# Altium schematic sheet H_Connecties.SchDoc
size A4; SheetNumber: 2; SheetTotal: 5
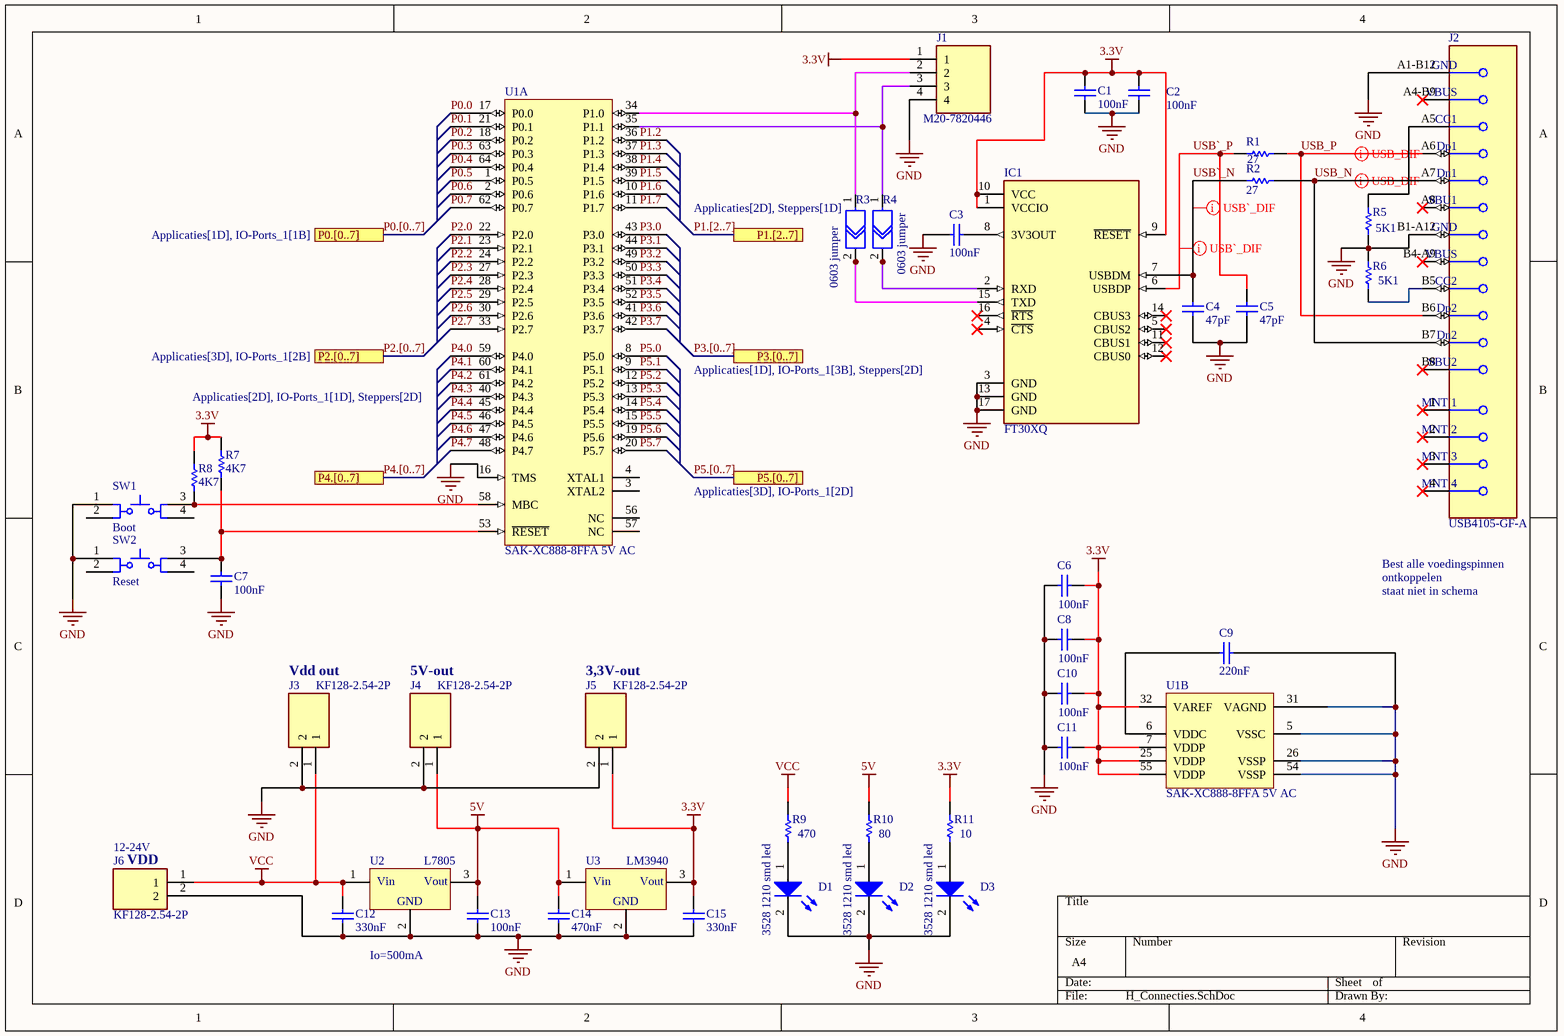
[diagram p0: H_Connecties.SchDoc]

## Parts
C1  100nF  [CAPC1608X90X35LL15T15]
C2  100nF  [CAPC1608X90X35LL15T15]
C3  100nF  [CAPC1608X90X35LL15T15]
C4  47pF  [CAPC1608X90X35LL15T15]
C5  47pF  [CAPC1608X90X35LL15T15]
C6  100nF  [CAPC1608X92X38NL15T08]
C7  100nF  [CAPC1608X90X35LL15T15]
C8  100nF  [CAPC1608X92X38NL15T08]
C9  220nF  [CAPC1608X95X40LL15T15]
C10  100nF  [CAPC1608X92X38NL15T08]
C11  100nF  [CAPC1608X92X38NL15T08]
C12  330nF  [CAPC1608X90X35LL15T15]
C13  100nF  [CAPC1608X90X35LL15T15]
C14  470nF  [CAPC1608X90X35LL15T15]
C15  330nF  [CAPC1608X90X35LL15T15]
D1  3528 1210 smd led  [WL-SITW_3528_L3.5W2.8H1.9]
D2  3528 1210 smd led  [WL-SITW_3528_L3.5W2.8H1.9]
D3  3528 1210 smd led  [WL-SITW_3528_L3.5W2.8H1.9]
IC1  FT30XQ  [FT30XQ]
J1  M20-7820446  [M20-4pin]
J2  USB4105-GF-A  [FP-USB4105-GF-A-MFG]
J3  KF128-2.54-2P  [KF128-2.54-2P]
J4  KF128-2.54-2P  [KF128-2.54-2P]
J5  KF128-2.54-2P  [KF128-2.54-2P]
J6  KF128-2.54-2P  [KF128-2.54-2P]
R1  27  [RESC1608X55X25LL10T15]
R2  27  [RESC1608X55X25LL10T15]
R3  0603 jumper  [0603 jumper]
R4  0603 jumper  [0603 jumper]
R5  5K1  [RESC1608X55X25LL10T15]
R6  5K1  [RESC1608X55X25LL10T15]
R7  4K7  [RESC1608X55X25LL10T15]
R8  4K7  [RESC1608X55X25LL10T15]
R9  470  [RESC1608X55X25LL10T15]
R10  80  [RESC1608X55X25LL10T15]
R11  10  [RESC1608X55X25LL10T15]
SW1  Boot  [ESWI-TL1105SPF_V]
SW2  Reset  [ESWI-TL1105SPF_V]
U1  SAK-XC888-8FFA 5V AC  [INF-PG-TQFP-64-8_L]  (parts A,B of 2)
U2  L7805  [DPAK]
U3  LM3940  [SOT-233]

## Ports
P0.[0..7] (see Applicaties[1D], IO-Ports_1[1B]), P1.[2..7] (see Applicaties[2D], Steppers[1D]), P2.[0..7] (see Applicaties[3D], IO-Ports_1[2B]), P3.[0..7] (see Applicaties[1D], IO-Ports_1[3B], Steppers[2D]), P4.[0..7] (see Applicaties[2D], IO-Ports_1[1D], Steppers[2D]), P5.[0..7] (see Applicaties[3D], IO-Ports_1[2D])

## Nets
3.3V: C1.2 C2.2 C6.2 C8.2 C10.2 C11.2 C15.2 IC1.1(VCCIO) IC1.9(~{RESET}) IC1.10(VCC) J1.1 J5.1 R7.2 R8.2 R11.1 U1.7(VDDP) U1.25(VDDP) U1.32(VAREF) U1.55(VDDP) U3.3
5V: C13.2 C14.2 J4.1 R10.1 U2.3 U3.1
GND: C1.1 C2.1 C3.2 C4.1 C5.1 C6.1 C7.1 C8.1 C9.2 C10.1 C11.1 C12.1 C13.1 C14.1 C15.1 D1.2(K) D2.2(K) D3.2(K) IC1.3(GND) IC1.13(GND) IC1.17(GND) J1.4 J2.A1-B12(GND) J2.B1-A12(GND) J3.2 J4.2 J5.2 J6.2 R5.2 R6.1 SW1.1 SW2.1 U1.5(VSSC) U1.16(TMS) U1.26(VSSP) U1.31(VAGND) U1.54(VSSP) U2.2 U3.2
VCC: C12.2 J3.1 J6.1 R9.1 U2.1
P0.0: U1.17(P0.0)
P0.1: U1.21(P0.1)
P0.2: U1.18(P0.2)
P0.3: U1.63(P0.3)
P0.4: U1.64(P0.4)
P0.5: U1.1(P0.5)
P0.6: U1.2(P0.6)
P0.7: U1.62(P0.7)
P1.2: U1.36(P1.2)
P1.3: U1.37(P1.3)
P1.4: U1.38(P1.4)
P1.5: U1.39(P1.5)
P1.6: U1.10(P1.6)
P1.7: U1.11(P1.7)
P2.0: U1.22(P2.0)
P2.1: U1.23(P2.1)
P2.2: U1.24(P2.2)
P2.3: U1.27(P2.3)
P2.4: U1.28(P2.4)
P2.5: U1.29(P2.5)
P2.6: U1.30(P2.6)
P2.7: U1.33(P2.7)
P3.0: U1.43(P3.0)
P3.1: U1.44(P3.1)
P3.2: U1.49(P3.2)
P3.3: U1.50(P3.3)
P3.4: U1.51(P3.4)
P3.5: U1.52(P3.5)
P3.6: U1.41(P3.6)
P3.7: U1.42(P3.7)
P4.0: U1.59(P4.0)
P4.1: U1.60(P4.1)
P4.2: U1.61(P4.2)
P4.3: U1.40(P4.3)
P4.4: U1.45(P4.4)
P4.5: U1.46(P4.5)
P4.6: U1.47(P4.6)
P4.7: U1.48(P4.7)
P5.0: U1.8(P5.0)
P5.1: U1.9(P5.1)
P5.2: U1.12(P5.2)
P5.3: U1.13(P5.3)
P5.4: U1.14(P5.4)
P5.5: U1.15(P5.5)
P5.6: U1.19(P5.6)
P5.7: U1.20(P5.7)
USB_N: J2.A7(Dn1) J2.B7(Dn2) R2.1
USB_P: J2.A6(Dp1) J2.B6(Dp2) R1.1
USB`_N: C4.2 IC1.7(USBDM) R2.2
USB`_P: C5.2 IC1.6(USBDP) R1.2
NetC3_1: C3.1 IC1.8(3V3OUT)
NetC7_2: C7.2 R7.1 SW2.3 U1.53(~{RESET})
NetC9_1: C9.1 U1.6(VDDC)
NetD1_1: D1.1(A) R9.2
NetD2_1: D2.1(A) R10.2
NetD3_1: D3.1(A) R11.2
NetIC1_2: IC1.2(RXD) R4.2
NetIC1_15: IC1.15(TXD) R3.2
NetJ1_2: J1.2 R3.1 U1.34(P1.0)
NetJ1_3: J1.3 R4.1 U1.35(P1.1)
NetJ2_A5: J2.A5(CC1) R5.1
NetJ2_B5: J2.B5(CC2) R6.2
NetR8_1: R8.1 SW1.3 U1.58(MBC)

Not connected (* = marked no-connect by the designer): IC1 4(~{CTS})* 5(CBUS2)* 11(CBUS1)* 12(CBUS0)* 14(CBUS3)* 16(~{RTS})*; J2 1(MNT_1)* 2(MNT_2)* 3(MNT_3)* 4(MNT_4)* A4-B9(VBUS)* A8(SBU1)* B4-A9(VBUS)* B8(SBU2)*; SW1 2 4; SW2 2 4; U1 3(XTAL2) 4(XTAL1) 56(NC) 57(NC)

## Buses and harness runs
bus P0.[0..7] = port P0.[0..7]
bus P1.[2..7] = port P1.[2..7]
bus P2.[0..7] = port P2.[0..7]
bus P3.[0..7] = port P3.[0..7]
bus P4.[0..7] = port P4.[0..7]
bus P5.[0..7] = port P5.[0..7]

## Layout directives
differential pair: USB_N, USB_P, USB`_N, USB`_P

## Notes on the sheet
- Best alle voedingspinnen
- ontkoppelen
- staat niet in schema
- Vdd out
- 5V-out
- 3,3V-out
- (near J6) 12-24V
- (near J6) VDD
- Io=500mA
- (in symbol L7805) Vin; Vout; GND
- (in symbol LM3940) Vin; Vout; GND

## Library data of the parts
C1-C5 C7 C12-C15 = CMP-2006-02133-1: Manufacturer: AVX Interconnect / Elco; Part Number: 0603ZC101KAT2A
C6 C8 C10 C11 = CMP-2006-01211-1: Manufacturer: Vitramon; Part Number: VJ0603Y104KXJAP
C9 = CMP-2006-00068-1: Part Number: VJ0603Y224KXXCW1BC; Manufacturer: Vitramon
D1-D3 = CMP-03913-90235592-1: 15414185BA210 WL-SITW SMT InfraRed TopLED Waterclear; Forward Current: 700mA; Wavelength: 850nm; Max Reverse Voltage (DC): 5V; Forward Voltage: 1.5V; Viewing Angle: 120°; Length: 3.2mm; NexarPartId: 90235592; Width: 2.8mm; RoHS: Compliant; Packaging: Tape and Reel; Max Operating Temperature: 85°C; Peak Wavelength: 850nm; Min Operating Temperature: -40°C; Height: 1.9mm
J1 = M20-7820446: Connector; Manufacturer_Name: Harwin; Datasheet Link: https://cdn.harwin.com/pdfs/M20-782.pdf; Height: 8.65mm; Manufacturer_Part_Number: M20-7820446; Mouser Part Number: 855-M20-7820446; Mouser Price/Stock: https://www.mouser.co.uk/ProductDetail/Harwin/M20-7820446?qs=vF78I%252BjhbY8%252Bno0H8mp9XA%3D%3D
J2 = CMP-245163-000001-1: CONN RCPT USB2.0 TYPEC 5A; Manufacturer: GCT; Voltage Rating: 20V; Is Female: yes; Current Rating: 5/6.25/1.25/0.25A; Number Of Contacts: 16; Conn Orientation: Right Angle; Device Class L1: Connectors; Category: Conn; Lead Free: Yes; RoHS: TRUE; Temperature Range High: +85°C; Digikey Description: CONN RCPT USB2.0 TYPEC 5A; Device Class L3: unset; ComponentLink2Description: Datasheet; Manufacturer Part Number: USB4105-GF-A; Package: 0; Usb Standard: USB 2.0; Device Class L2: USB Connectors; Automotive: No; Temperature Range Low: -40°C; Height: 3.46mm; Temperature: -40°C to +85°C; Contact Material: Gold,Nickel; ComponentLink2URL: https://gct.co/files/drawings/usb4105.pdf; Octopart: https://octopart.com/usb4105-gf-a-gct-106627878
J3-J6 = KF128-2.54-2P: Connector; Manufacturer_Name: CIXI KEFA ELECTRONICS; Datasheet Link: https://jirorwxhqiillo5p.ldycdn.com/KF128-2.54-aidqpBpqKirRliSqmrqirlki.pdf; Height: 9.1mm; Manufacturer_Part_Number: KF128-2.54-2P
R1 R2 R5-R11 = CMP-2000-04183-1: Part Number: RC0603FR-102KL; Manufacturer: Yageo
SW1 SW2 = CMP-2000-07248-1: Tact Switch, SPST-NO, 50 mA, 12 VDC, -20 to 70 degC, 4-Pin THD, RoHS, Bulk; Manufacturer: E-Switch; Actuation Force: 1.6N; Actuator Style: RoundButton; Package URL: http://spec_sheets.e-switch.com/specs/P010201.pdf; Contact Material: Silver; Size: 6x6mm; Manufacturer URL: http://www.e-switch.ch/en/; Datasheet Version: 12/2013; Package Description: 4-Pin Through Hole Device, Body 6 x 6 mm; Datasheet URL: https://www.e-switch.com/system/asset/product_line/data_sheet/140/TL1105.pdf; Termination Style: RightAngle; Package Reference: TL1105SPF; Mounting Technology: ThroughHole
U1 = CMP-1147-00075-1: 24 MHz XC800-Automotive MCU with 32 KByte Program Memory, 1.75 KByte SRAM, 5 V, PG-LQFP-64, Reel, Green; Manufacturer: Infineon; A / D input lines (incl. FADC): 8; Digital I/O Lines: 48; Oscillator Watchdog: TRUE; Serial I/O Interfaces: 3; Real Time Clock (RTC): FALSE; I/O Operation Voltages: 5Â V; Program Memory: 32Â KByte; SRAM (incl. Cache): 1.75Â KByte; Max Clock Frequency: 24Â MHz; Type of Memory: Flash; Timer / Counter: 4; CAN Nodes: 0; Type of Serial I/O Interfaces: UART(2), SSC(1); Number of ADC Modules: 1; LIN BSL loader (for fast Flash programming): FALSE; ComponentLink2Description: Datasheet; ComponentLink2URL: http://www.infineon.com/dgdl/XC88xCLM_ds_V1_2.pdf?folderId=db3a304412b407950112b408e8c90004&fileId=db3a304412b407950112b40c4a9e0afb; ComponentLink3URL: http://www.infineon.com/dgdl/xc164lm_ds_v1.2_2007_03.pdf?folderId=db3a304412b407950112b408e8c90004&fileId=db3a304412b407950112b40c22200a81&sId=db3a30433d956bc3013d9e7060dd2801; PartNumber: SAK-XC888-8FFA 5V AC; PackageReference: PG-TQFP-64-8; PackageDescription: 64-Pin Plastic Thin Quad Flat Package, Body 10 x 10 mm, Pitch 0.5 mm; DSP functionality (e.g MDU/MAC): FALSE; On-chip Voltage Regulator: TRUE; On-chip clock generation: TRUE; Mounting Technology: Surface Mount; Green: TRUE; Watchdog Timer: TRUE; Instruction width [bits]: 8; DatasheetVersion: Rev. 1.2; Halogen-free: TRUE; ComponentLink1Description: Manufacturer URL; PackageVersion: V1.2, 03/2007; ComponentLink1URL: http://www.infineon.com/; Timed I/O Pins (PWM-Ch,CAPCOM): 4; Power Modes: 4; DMA Channels: 0; ComponentLink3Description: Package Specification; E2PROM Emulation (Data-Flash): TRUE
U2 = L7805: Linaire spannings omvormer
U3 = LM3940: 5V --> 3.3V